# EAGLE design Bluetooth BM20 Breakout (EAGLE 9.6.2)
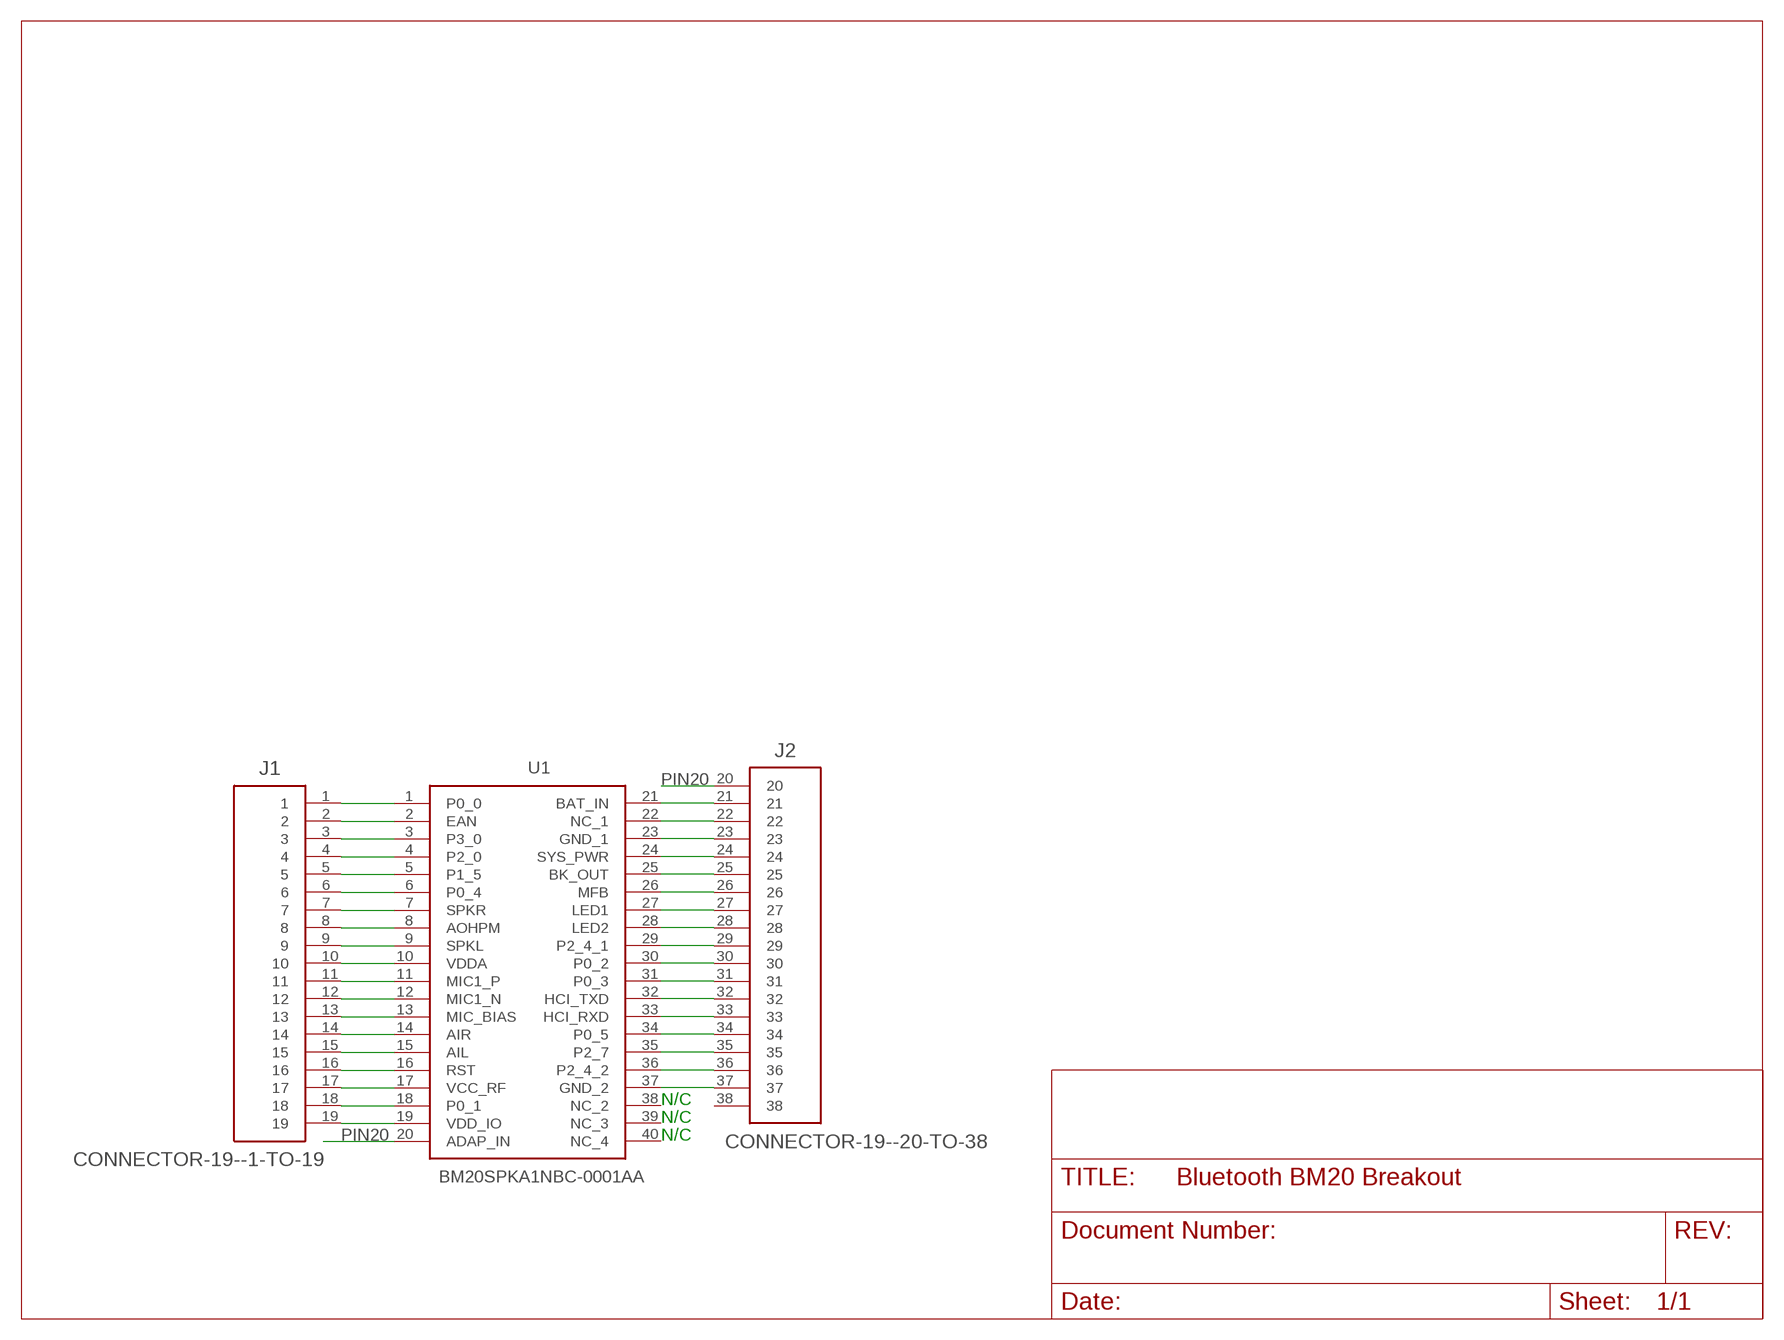
[diagram p0: schematic, sheet 1]

## Parts
J1  CONNECTOR-19--1-TO-19  [ESQ-119-XX-XX-S]
J2  CONNECTOR-19--20-TO-38  [ESQ-119-XX-XX-S--PIN-1-ROUND]
U1  BM20SPKA1NBC-0001AA  [BM20SPKA1NBC0001AA]

## Nets
N$1: J1.4 U1.4(P2_0)
N$2: J1.1 U1.1(P0_0)
N$3: J1.5 U1.5(P1_5)
N$4: J1.2 U1.2(EAN)
N$5: J1.6 U1.6(P0_4)
N$6: J1.3 U1.3(P3_0)
N$7: J1.7 U1.7(SPKR)
N$8: J1.8 U1.8(AOHPM)
N$9: J1.9 U1.9(SPKL)
N$10: J1.10 U1.10(VDDA)
N$11: J1.11 U1.11(MIC1_P)
N$12: J1.12 U1.12(MIC1_N)
N$13: J1.13 U1.13(MIC_BIAS)
N$14: J1.14 U1.14(AIR)
N$15: J1.15 U1.15(AIL)
N$16: J1.16 U1.16(RST)
N$17: J1.17 U1.17(VCC_RF)
N$18: J1.18 U1.18(P0_1)
N$19: J1.19 U1.19(VDD_IO)
N$20: J2.23 U1.23(GND_1)
N$21: J2.24 U1.24(SYS_PWR)
N$22: J2.21 U1.21(BAT_IN)
N$23: J2.25 U1.25(BK_OUT)
N$24: J2.22 U1.22(NC_1)
N$25: J2.26 U1.26(MFB)
N$26: J2.27 U1.27(LED1)
N$27: J2.28 U1.28(LED2)
N$28: J2.29 U1.29(P2_4_1)
N$29: J2.30 U1.30(P0_2)
N$30: J2.31 U1.31(P0_3)
N$31: J2.32 U1.32(HCI_TXD)
N$32: J2.33 U1.33(HCI_RXD)
N$33: J2.34 U1.34(P0_5)
N$34: J2.35 U1.35(P2_7)
N$35: J2.36 U1.36(P2_4_2)
N$36: J2.37 U1.37(GND_2)
PIN20: J2.20 U1.20(ADAP_IN)
Unconnected: J2.38 U1.38(NC_2) U1.39(NC_3) U1.40(NC_4)

## Notes on the sheet
- N/C
- N/C
- N/C

## Library data of the parts
J1 = eagle-library-engr-245-s22:CONNECTOR-19--1-TO-19
J2 = eagle-library-engr-245-s22:CONNECTOR-19--20-TO-38
U1 = eagle-library-engr-245-s22:BM20SPKA1NBC-0001AA: Bluetooth Modules (802.15.1) BT 4.1 Stereo Audio No-Shield/Antenna Source: Datasheet <https://componentsearchengine.com/Datasheets/1/BM20SPKA1NBC-0001AA.pdf>; DESCRIPTION: Bluetooth Modules (802.15.1) BT 4.1 Stereo Audio No-Shield/Antenna; HEIGHT: 2.5mm; MANUFACTURER_NAME: Microchip; MANUFACTURER_PART_NUMBER: BM20SPKA1NBC-0001AA; MOUSER_PART_NUMBER: 579-SPKA1NBC-0001AA; MOUSER_PRICE-STOCK: https://www.mouser.co.uk/ProductDetail/Microchip-Technology/BM20SPKA1NBC-0001AA?qs=uus7iwvxYD8HqvnWsd76VQ%3D%3D

## Board
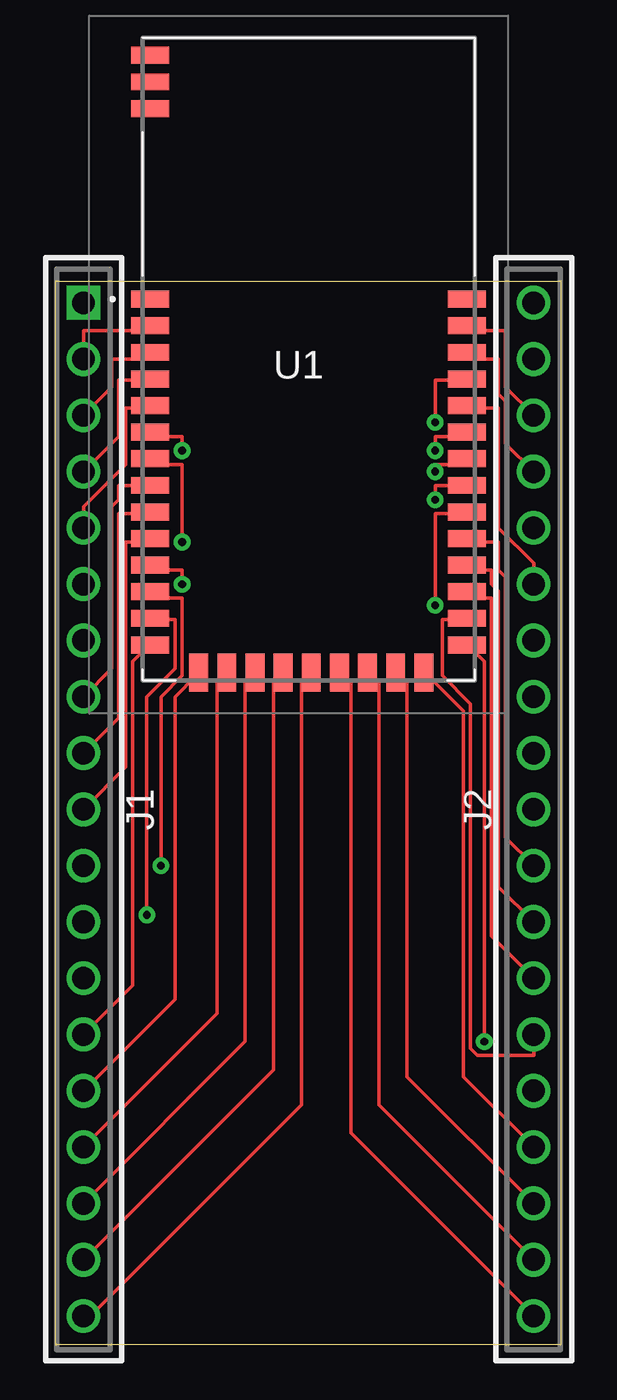
[diagram p1: board, top side]
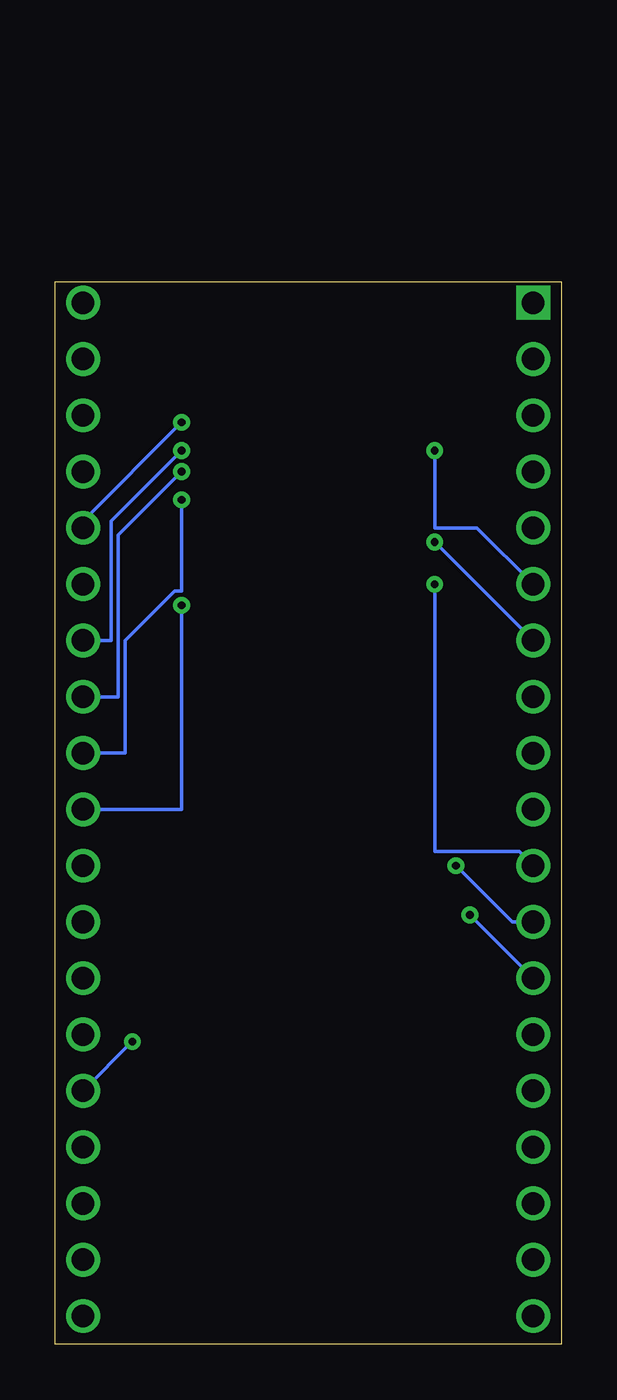
[diagram p2: board, bottom side, seen from below]

Size 22.84 x 47.93 mm. Coordinates in mm from the lower left corner, seen from the top.
Outline: 0,0 22.84,0 22.84,47.93 0,47.93 0,0
Copper layers (1*16): Top 0.035mm / dielectric 1.5mm / Bottom 0.035mm
Design rules "default": minimum track width 6mil, minimum drill 0.35mm, track to track 6mil, track to pad 6mil, pad to pad 6mil, via to via 6mil, smd to smd 6mil, copper to edge 40mil, drill to drill 6mil, minimum pad ring 10mil, minimum via ring 8mil, stop-mask expansion 4mil, vias tented up to drill 0mil, thermal gap 10mil

### Footprints (pad centres in the part's own frame; a part is rotated, then mirrored left to right if it is on the bottom)
ESQ-119-XX-XX-S = drill 1.016 pad 1.524 square: 1 0,0 | drill 1.016 pad 1.524: 2 2.54,0; 3 5.08,0; 4 7.62,0; 5 10.16,0; 6 12.7,0; 7 15.24,0; 8 17.78,0; 9 20.32,0; 10 22.86,0; 11 25.4,0; 12 27.94,0; 13 30.48,0; 14 33.02,0; 15 35.56,0; 16 38.1,0; 17 40.64,0; 18 43.18,0; 19 45.72,0
ESQ-119-XX-XX-S--PIN-1-ROUND = drill 1.016 pad 1.524: 20 -22.86,0; 21 -20.32,0; 22 -17.78,0; 23 -15.24,0; 24 -12.7,0; 25 -10.16,0; 26 -7.62,0; 27 -5.08,0; 28 -2.54,0; 29 0,0; 30 2.54,0; 31 5.08,0; 32 7.62,0; 33 10.16,0; 34 12.7,0; 35 15.24,0; 36 17.78,0; 37 20.32,0; 38 22.86,0
BM20SPKA1NBC0001AA = smd 1.7 x 0.76: 1 -7.15,2.7; 2 -7.15,1.5; 3 -7.15,0.3; 4 -7.15,-0.9; 5 -7.15,-2.1; 6 -7.15,-3.3; 7 -7.15,-4.5; 8 -7.15,-5.7; 9 -7.15,-6.9; 10 -7.15,-8.1; 11 -7.15,-9.3; 12 -7.15,-10.5; 13 -7.15,-11.7; 14 -7.15,-12.9; 24 7.15,-12.9; 25 7.15,-11.7; 26 7.15,-10.5; 27 7.15,-9.3; 28 7.15,-8.1; 29 7.15,-6.9; 30 7.15,-5.7; 31 7.15,-4.5; 32 7.15,-3.3; 33 7.15,-2.1; 34 7.15,-0.9; 35 7.15,0.3; 36 7.15,1.5; 37 7.15,2.7; 38 -7.15,13.7; 39 -7.15,12.5; 40 -7.15,11.3 | smd 0.85 x 1.7: 15 -4.96,-14.15; 16 -3.69,-14.15; 17 -2.42,-14.15; 18 -1.15,-14.15; 19 0.12,-14.15; 20 1.39,-14.15; 21 2.66,-14.15; 22 3.93,-14.15; 23 5.2,-14.15

### Placement (x,y rotation side)
J1  1.27,46.99 270 top
J2  21.59,24.13 90 top
U1  11.43,44.45 0 top

### Tracks (layer width: path | path; a pad name or v marks a point on that pad's centre or on a via)
N$1
  Top 0.152: J1.4 2.86,40.96 2.86,43.5 4.13,43.5 U1.4
N$3
  Top 0.152: J1.5 1.27,37.78 3.17,39.69 3.17,42.23 4.13,42.23 U1.5
N$4
  Top 0.152: J1.2 1.27,45.72 4.13,45.72 U1.2
N$5  (via drill 0.35)
  Top 0.152: v5.71,40.32 5.71,40.96 4.45,40.96 U1.6
  Bottom 0.152: v5.71,40.32 5.71,36.83 3.81,36.83 J1.6
N$6
  Top 0.152: J1.3 2.54,43.18 2.54,44.45 4.13,44.45 U1.3
N$7  (via drill 0.35)
  Top 0.152: v5.71,36.2 5.71,39.69 4.45,39.69 U1.7
  Bottom 0.152: J1.7 v5.71,36.2
N$8
  Top 0.152: J1.8 2.54,30.48 2.54,37.78 2.86,38.1 2.86,38.73 4.13,38.73 U1.8
N$9
  Top 0.152: J1.9 2.86,28.26 2.86,37.47 4.13,37.47 U1.9
N$10
  Top 0.152: J1.10 3.17,26.04 3.17,36.2 4.13,36.2 U1.10
N$11  (via drill 0.35)
  Top 0.152: v5.71,34.29 5.71,34.92 4.45,34.92 U1.11
  Bottom 0.152: v5.71,34.29 5.71,22.23 1.91,22.23 J1.11
N$12  (via drill 0.35)
  Top 0.152: v4.76,21.59 4.76,29.21 5.71,30.16 5.71,33.66 4.45,33.66 U1.12
  Bottom 0.152: v4.76,21.59 2.22,19.05 J1.12
N$13  (via drill 0.35)
  Top 0.152: v4.13,19.37 4.13,29.21 5.4,30.48 5.4,32.7 4.45,32.7 U1.13
  Bottom 0.152: J1.13 v4.13,19.37
N$14
  Top 0.152: J1.14 3.49,16.19 3.49,30.8 4.13,31.43 U1.14
N$15
  Top 0.152: J1.15 5.4,15.56 5.4,29.21 6.35,30.16 U1.15
N$16
  Top 0.152: J1.16 7.3,14.92 7.3,29.84 7.62,30.16 U1.16
N$17
  Top 0.152: J1.17 8.57,13.65 8.57,29.84 8.89,30.16 U1.17
N$18
  Top 0.152: J1.18 9.84,12.38 9.84,29.84 10.16,30.16 U1.18
N$19
  Top 0.152: J1.19 1.59,1.27 11.11,10.79 11.11,29.84 11.43,30.16 U1.19
N$20
  Top 0.152: J2.23 18.41,12.06 18.41,28.57 16.83,30.16 U1.23
N$21  (via drill 0.35)
  Top 0.152: v19.37,13.65 19.37,30.8 18.73,31.43 U1.24
  Bottom 0.152: J2.24 v19.37,13.65
N$22
  Top 0.152: J2.21 14.61,10.79 14.61,29.84 14.29,30.16 U1.21
N$23
  Top 0.152: J2.25 21.59,13.02 19.05,13.02 18.73,13.34 18.73,28.89 17.46,30.16 17.46,32.7 18.41,32.7 U1.25
N$24
  Top 0.152: J2.22 15.88,12.06 15.88,29.84 15.56,30.16 U1.22
N$25
  Top 0.152: J2.26 19.68,18.41 19.68,33.66 18.73,33.66 U1.26
N$26
  Top 0.152: J2.27 20,20.64 20,33.97 19.68,34.29 19.68,34.92 18.73,34.92 U1.27
N$27
  Top 0.152: J2.28 20.32,22.86 20.32,34.61 20,34.92 20,36.2 18.73,36.2 U1.28
N$28  (via drill 0.35)
  Top 0.152: v17.14,33.34 17.14,37.47 18.41,37.47 U1.29
  Bottom 0.152: v17.14,33.34 17.14,24.13 J2.29
N$29  (via drill 0.35)
  Top 0.152: v17.14,38.1 17.14,38.73 18.41,38.73 U1.30
  Bottom 0.152: v17.14,38.1 17.14,33.97 17.46,33.97 19.68,31.75 19.68,26.67 J2.30
N$30  (via drill 0.35)
  Top 0.152: v17.14,39.37 17.14,39.69 18.41,39.69 U1.31
  Bottom 0.152: v17.14,39.37 20,36.51 20,29.21 J2.31
N$31  (via drill 0.35)
  Top 0.152: v17.14,40.32 17.14,40.96 18.41,40.96 U1.32
  Bottom 0.152: v17.14,40.32 20.32,37.15 20.32,31.75 J2.32
N$32
  Top 0.152: J2.33 21.59,35.24 20,36.83 20,42.23 18.73,42.23 U1.33
N$33  (via drill 0.35)
  Top 0.152: v17.14,41.59 17.14,43.5 18.41,43.5 U1.34
  Bottom 0.152: v17.14,41.59 21.59,37.15 J2.34
N$34
  Top 0.152: J2.35 20.32,40.64 20.32,42.55 20,42.86 20,44.45 18.73,44.45 U1.35
N$35
  Top 0.152: J2.36 20.32,43.18 20.32,45.72 18.73,45.72 U1.36
PIN20
  Top 0.152: J2.20 13.34,9.53 13.34,29.84 13.02,30.16 U1.20